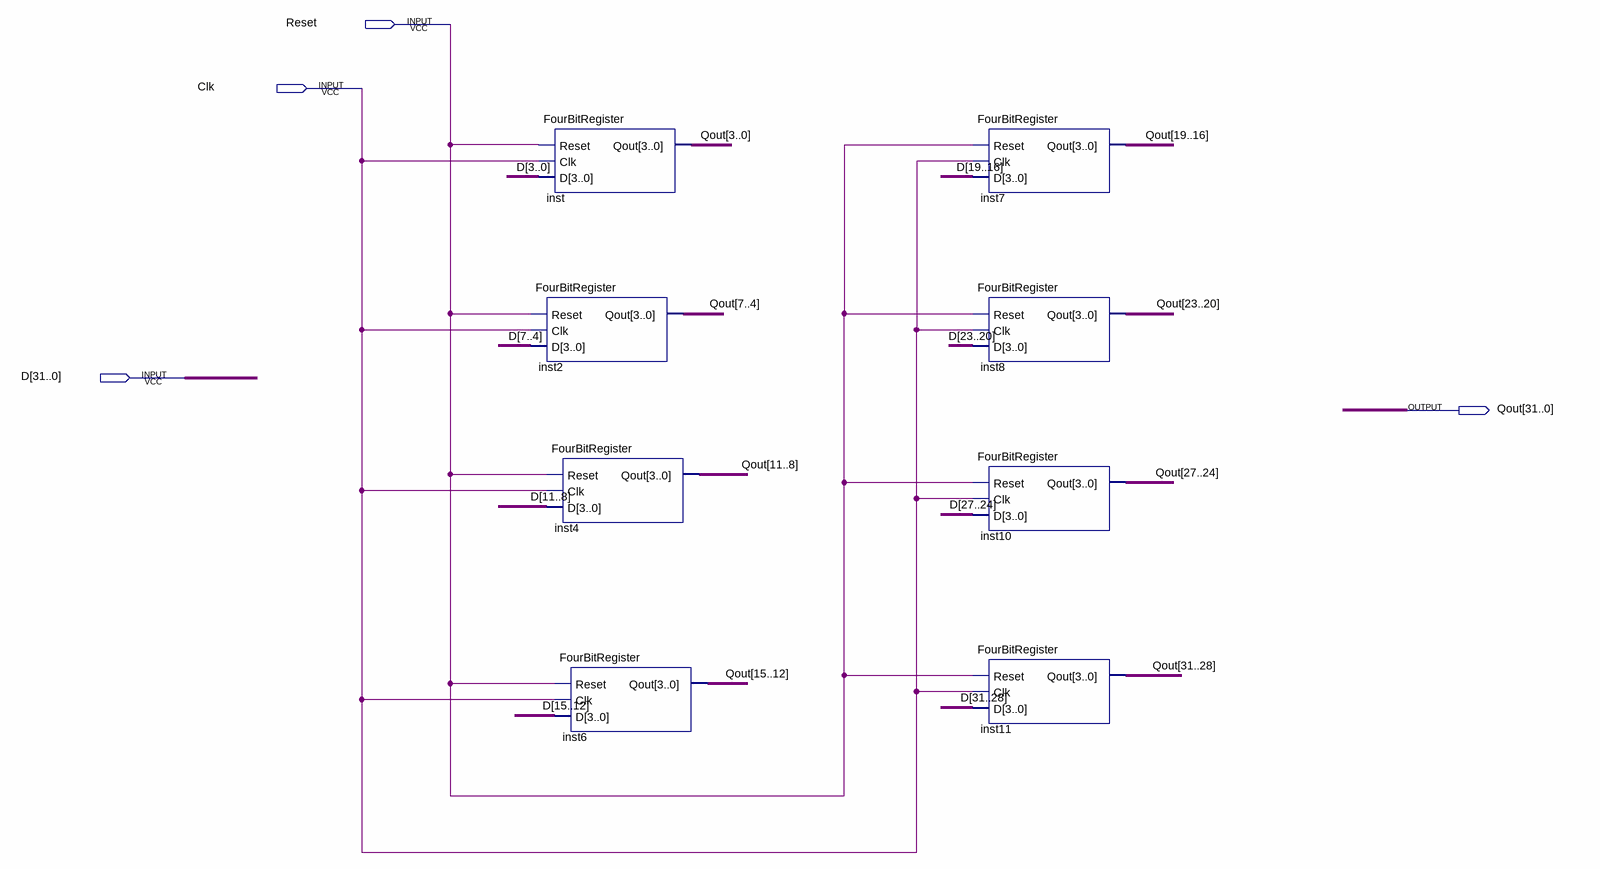
[diagram p0: schematic sheet]
// Quartus schematic ThirtyTwoBitReg.bdf as structural Verilog: 8 symbols, 4 pins
module ThirtyTwoBitReg (
  input  Reset,
  input  Clk,
  input  [31:0] D,
  output [31:0] Qout
);

  FourBitRegister inst (.Reset(Reset), .Clk(Clk), .D(D[3:0]), .Qout(Qout[3:0]));
  FourBitRegister inst2 (.Reset(Reset), .Clk(Clk), .D(D[7:4]), .Qout(Qout[7:4]));
  FourBitRegister inst4 (.Reset(Reset), .Clk(Clk), .D(D[11:8]), .Qout(Qout[11:8]));
  FourBitRegister inst6 (.Reset(Reset), .Clk(Clk), .D(D[15:12]), .Qout(Qout[15:12]));
  FourBitRegister inst7 (.Reset(Reset), .Clk(Clk), .D(D[19:16]), .Qout(Qout[19:16]));
  FourBitRegister inst8 (.Reset(Reset), .Clk(Clk), .D(D[23:20]), .Qout(Qout[23:20]));
  FourBitRegister inst10 (.Reset(Reset), .Clk(Clk), .D(D[27:24]), .Qout(Qout[27:24]));
  FourBitRegister inst11 (.Reset(Reset), .Clk(Clk), .D(D[31:28]), .Qout(Qout[31:28]));
endmodule
